# EAGLE board L1_2025_v1.4 (EAGLE 9.6.2), part 1 of 2
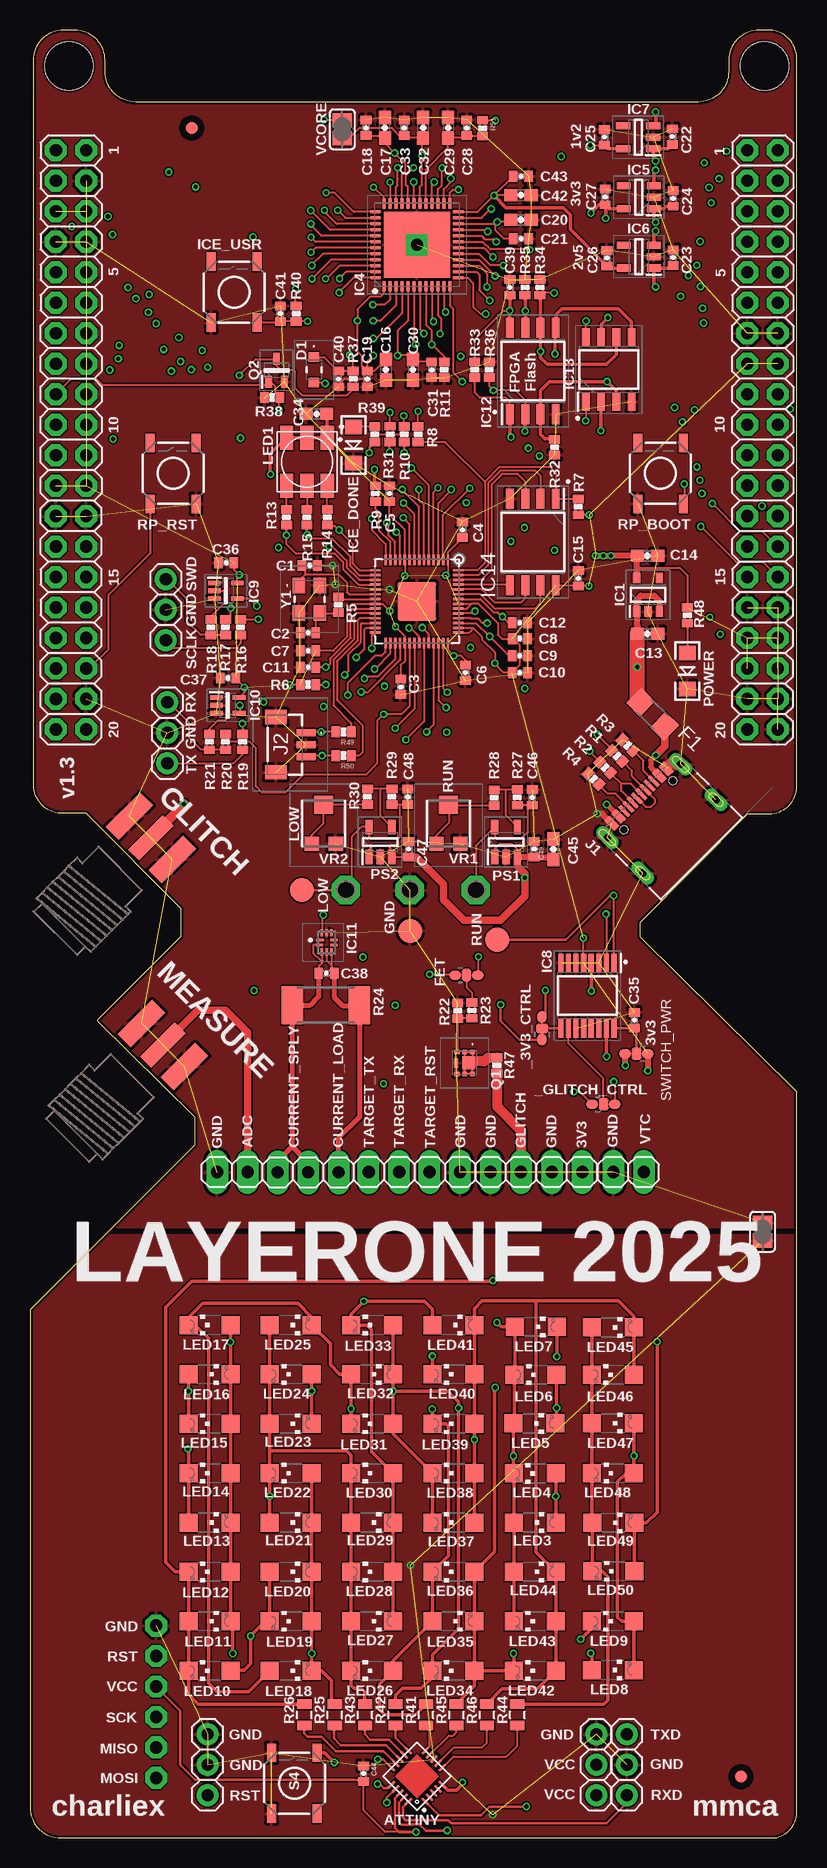
[diagram p6: board, top side]
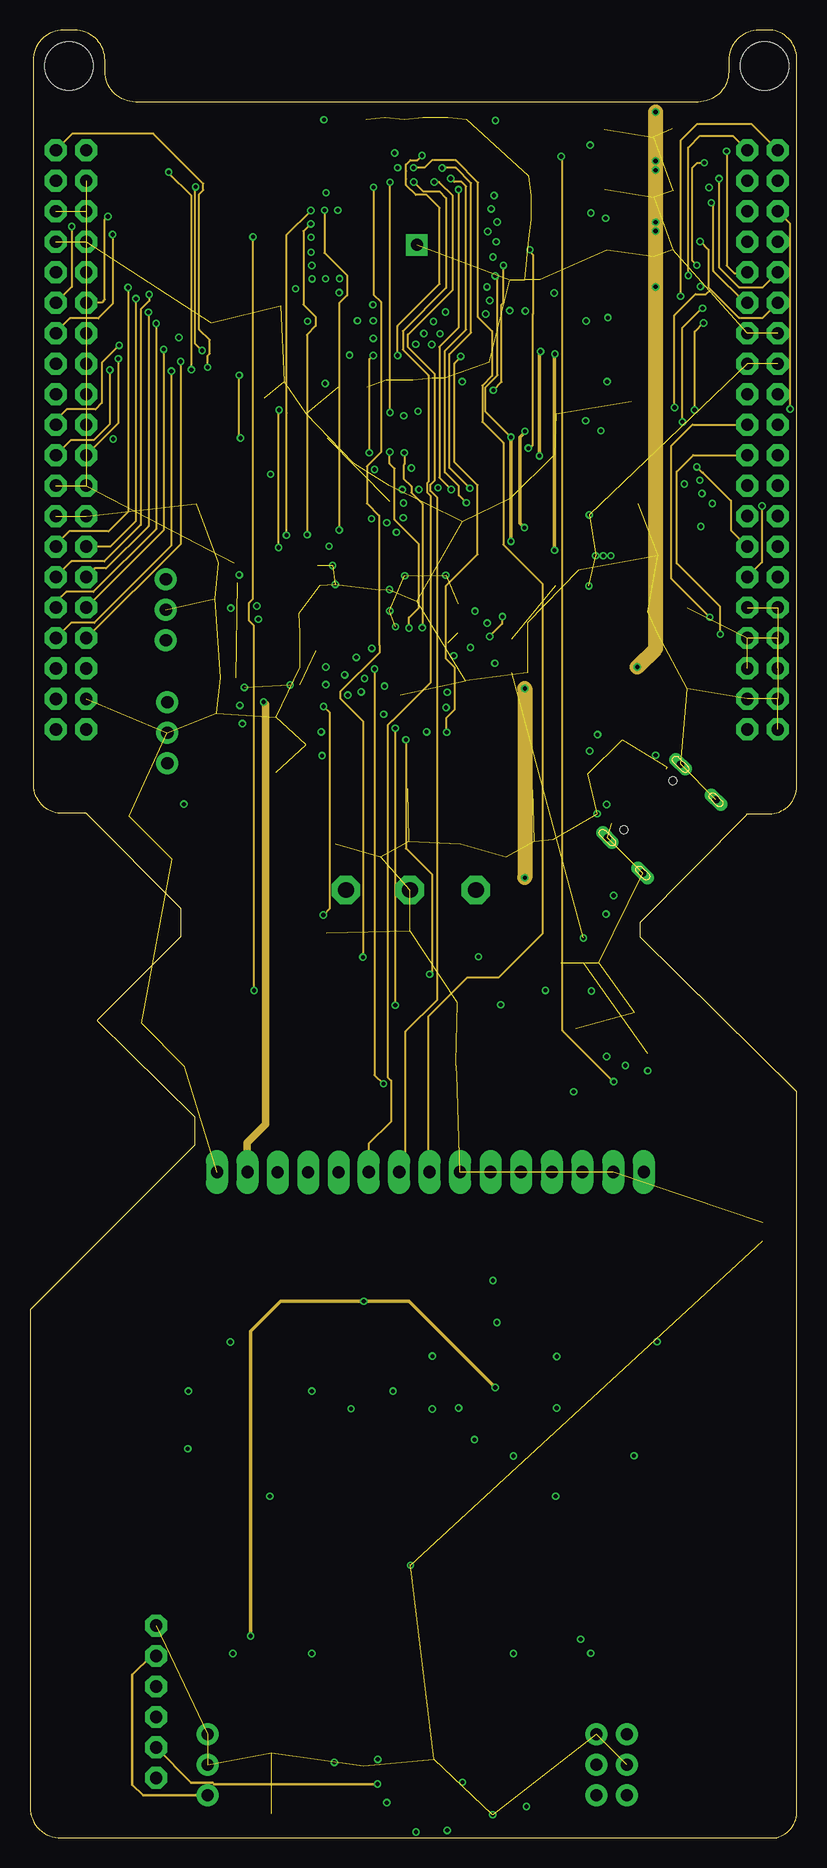
[diagram p7: board, inner layer Route2]
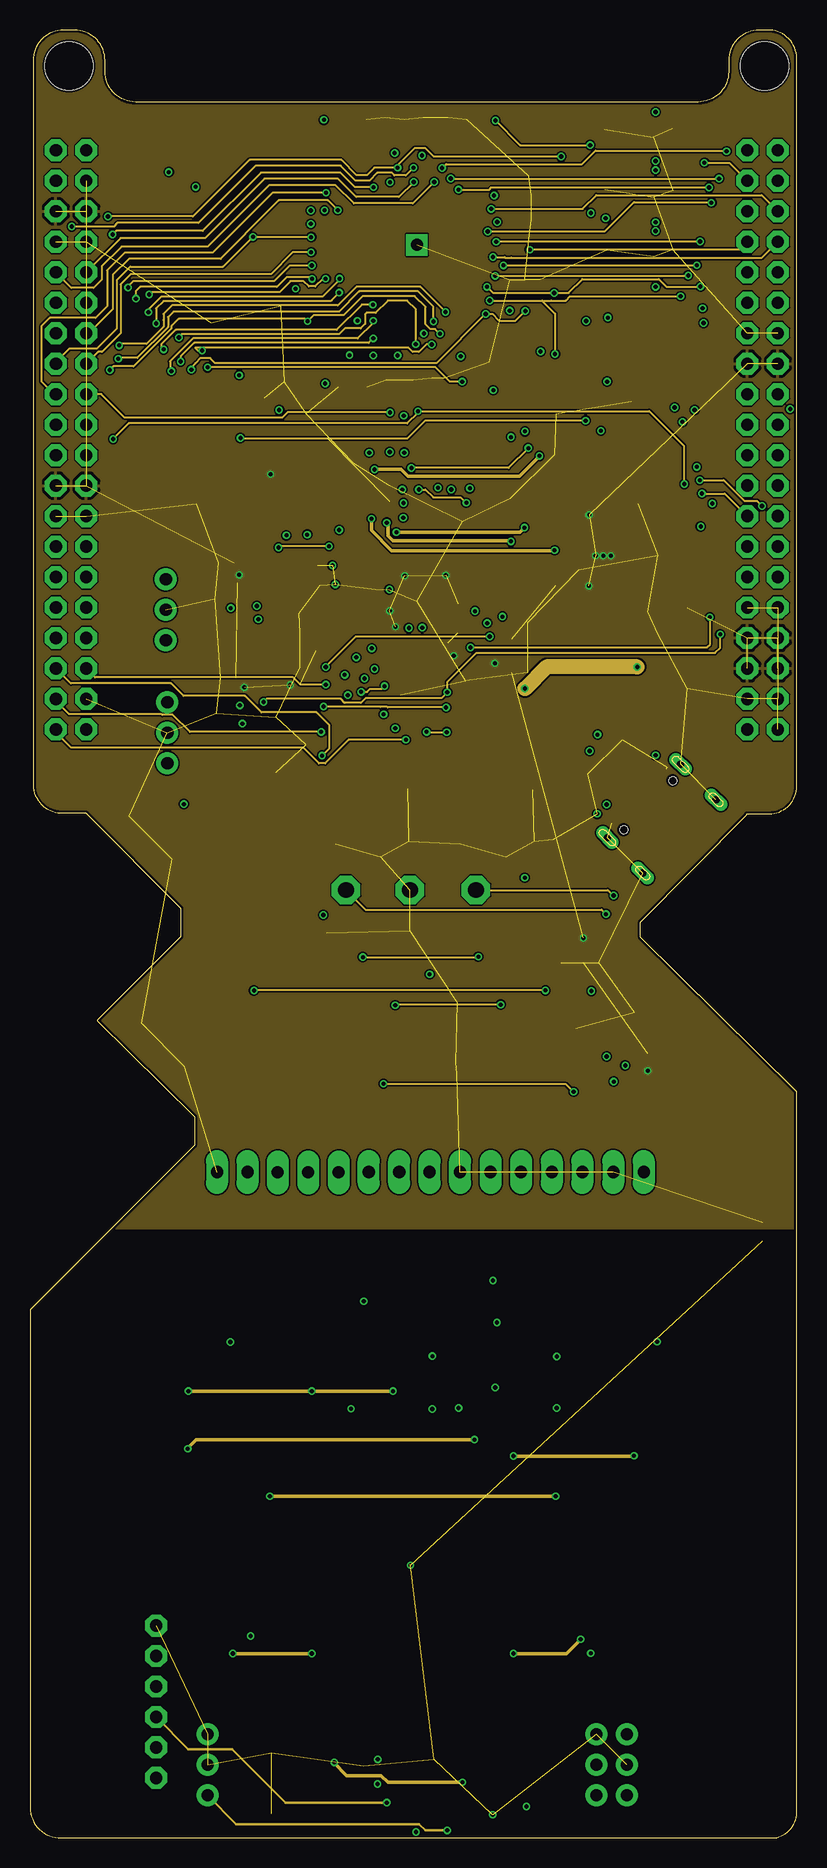
[diagram p8: board, inner layer Route15]
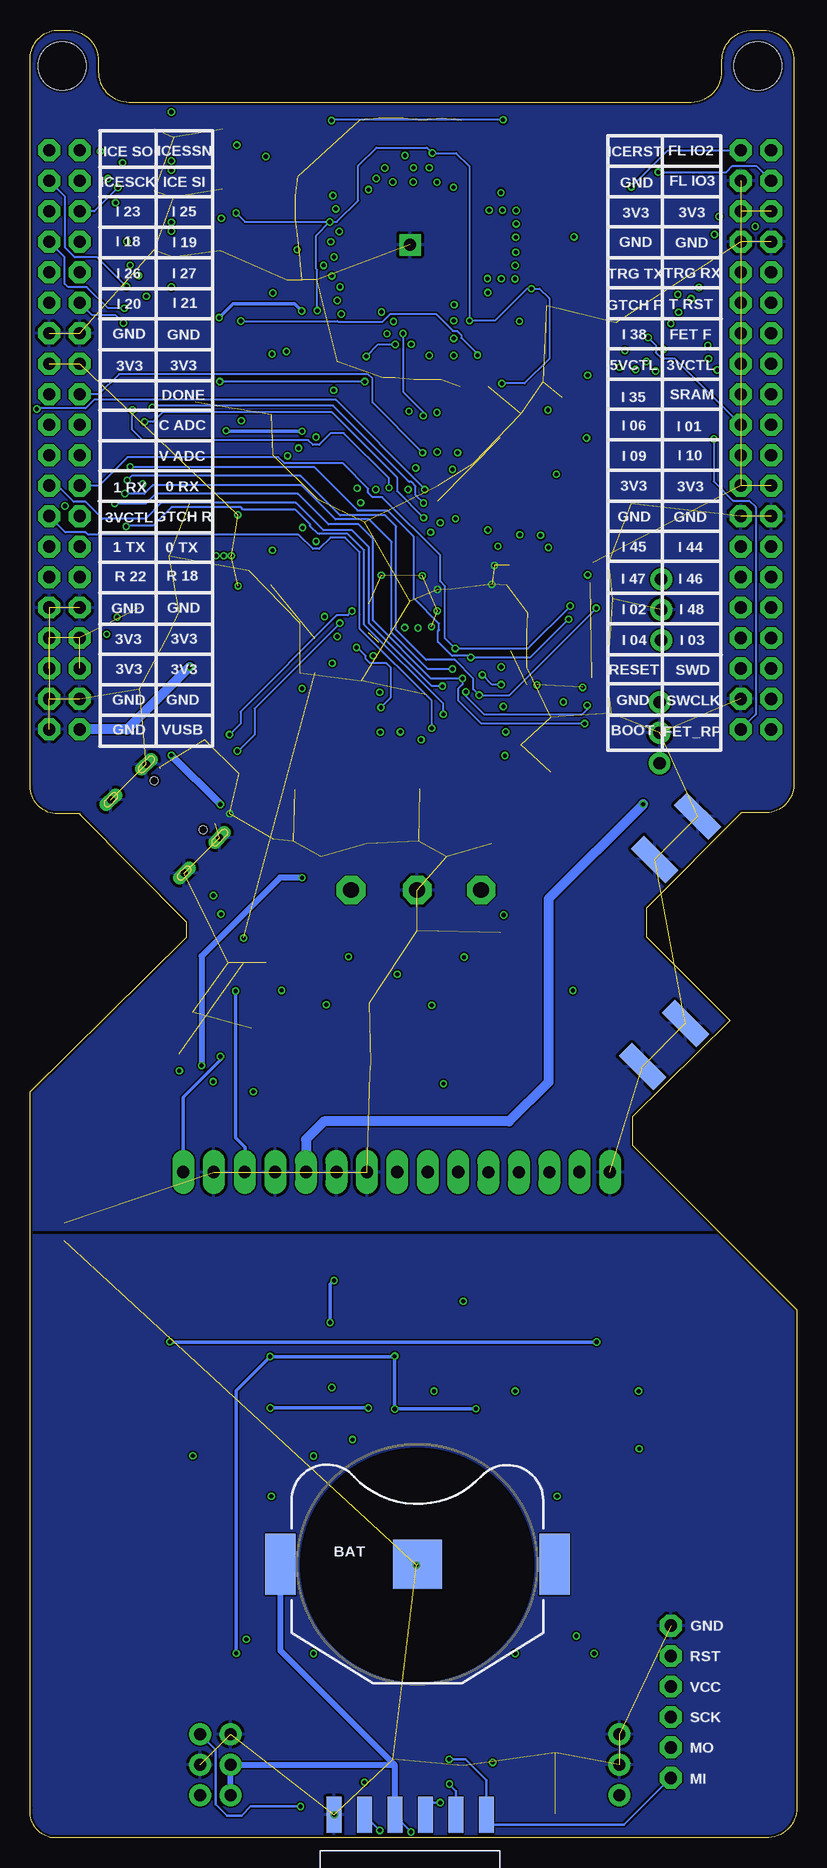
[diagram p9: board, bottom side, seen from below]

Size 63.96 x 150.67 mm. Coordinates in mm from the lower left corner, seen from the top.
Outline: 63.93,2.52 63.96,56.06 63.96,62.18 50.9,75.06 50.9,76.33 59.77,85.27 59.77,85.34 61.65,85.34 arc90 63.93,87.63 63.93,148.1 63.93,148.1 arc90 61.72,150.67 60.8,150.67 arc90 58.26,148.13 58.26,147.21 arc-90 55.72,144.67 8.8,144.67 arc-90 6.26,147.21 6.26,148.13 arc90 3.72,150.67 2.8,150.67 arc90 0.26,148.13 0.26,87.96 arc90 2.54,85.42 4.65,85.42 12.57,77.5 12.57,75.11 5.61,68.15 5.61,68.12 13.72,60.1 13.72,57.73 0,44.02 0,2.54 arc90 2.61,0 62.05,0 arc90 63.93,2.52
Copper layers (1+2*15+16): Top 0.035mm / dielectric 0.2mm / Route2 0.0175mm / dielectric 1.065mm / Route15 0.0175mm / dielectric 0.2mm / Bottom 0.035mm
Design rules "jlcpcb-4layers": minimum track width 3.5mil, minimum drill 0.2mm, track to track 5mil, track to pad 0.2mm, pad to pad 5mil, via to via 0.5mm, smd to smd 5mil, copper to edge 0.2mm, drill to drill 6mil, minimum pad ring 10mil, minimum via ring 0.13mm, stop-mask expansion 0.05mm, vias tented up to drill 16mil, thermal gap 10mil
Net classes: 1 LED: width 0.203 mm
Holes 4 mm at 61.26,147.67 3.26,147.67
bRestrict: area 25.8,16.9 to 37.5,28.6

## Footprints (pad centres in the part's own frame; a part is rotated, then mirrored left to right if it is on the bottom)
C0R-JMP = smd 0.8 x 1: 1 0,0.938; 3 0,-0.938 | smd 1 x 0.8: 2 0,0
1X03:1 = drill 1.016 long: 1 -2.54,0; 2 0,0; 3 2.54,0
FIDUCIAL_1MM = smd 1 x 1: 1 0,0
MLF20 = smd 0.8 x 0.23: P$1 -2,1; P$2 -2,0.5; P$3 -2,0; P$4 -2,-0.5; P$5 -2,-1; P$11 2,-1; P$12 2,-0.5; P$13 2,0; P$14 2,0.5; P$15 2,1 | smd 0.23 x 0.8: P$6 -1,-2; P$7 -0.5,-2; P$8 0,-2; P$9 0.5,-2; P$10 1,-2; P$16 1,2; P$17 0.5,2; P$18 0,2; P$19 -0.5,2; P$20 -1,2
SPARKFUN_BATTCOM_20MM_LINX = smd 2.54 x 5.08: 1 -11.43,0; 3 11.43,0 | smd 4.064 x 4.064: 2 0,0
0402-CAP = smd 0.7 x 0.9: 1 -0.65,0; 2 0.65,0
0603-CAP = smd 1.1 x 1: 1 -0.85,0; 2 0.85,0
RB500VM40TE17 = smd 0.9 x 0.8: 1 0,1.05; 2 0,-1.05
R1206 = smd 1.6 x 1.803: 1 -1.422,0; 2 1.422,0
SMA_EDGELAUNCH = smd 4.064 x 1.524: GND@1 2.032,-2.54; GND@2 2.032,2.54 | smd 4.064 x 1.524 bottom: GND@3 2.032,2.54; GND@4 2.032,-2.54 | smd 4.064 x 1.27: P 2.032,0
P1-13 = drill 1.321 pad 2.159 octagon: TP 0,0
SOT95P280X130-5N = smd 0.9 x 0.6: 1 -1.4,0.95; 2 -1.4,0; 3 -1.4,-0.95; 4 1.4,-0.95; 5 1.4,0.95
ADAFRUIT_MICRO_QFN56_7MM_REDUCEDEPAD = smd 0.875 x 0.2: 1 -3.45,2.6; 2 -3.45,2.2; 3 -3.45,1.8; 4 -3.45,1.4; 5 -3.45,1; 6 -3.45,0.6; 7 -3.45,0.2; 8 -3.45,-0.2; 9 -3.45,-0.6; 10 -3.45,-1; 11 -3.45,-1.4; 12 -3.45,-1.8; 13 -3.45,-2.2; 14 -3.45,-2.6; 29 3.45,-2.6; 30 3.45,-2.2; 31 3.45,-1.8; 32 3.45,-1.4; 33 3.45,-1; 34 3.45,-0.6; 35 3.45,-0.2; 36 3.45,0.2; 37 3.45,0.6; 38 3.45,1; 39 3.45,1.4; 40 3.45,1.8; 41 3.45,2.2; 42 3.45,2.6 | smd 0.2 x 0.875: 15 -2.6,-3.45; 16 -2.2,-3.45; 17 -1.8,-3.45; 18 -1.4,-3.45; 19 -1,-3.45; 20 -0.6,-3.45; 21 -0.2,-3.45; 22 0.2,-3.45; 23 0.6,-3.45; 24 1,-3.45; 25 1.4,-3.45; 26 1.8,-3.45; 27 2.2,-3.45; 28 2.6,-3.45; 43 2.6,3.45; 44 2.2,3.45; 45 1.8,3.45; 46 1.4,3.45; 47 1,3.45; 48 0.6,3.45; 49 0.2,3.45; 50 -0.2,3.45; 51 -0.6,3.45; 52 -1,3.45; 53 -1.4,3.45; 54 -1.8,3.45; 55 -2.2,3.45; 56 -2.6,3.45 | smd 3.2 x 3.2: P$1 0,0
QFN50P700X700X100-49N = smd 0.85 x 0.25: 1 -3.45,2.75; 2 -3.45,2.25; 3 -3.45,1.75; 4 -3.45,1.25; 5 -3.45,0.75; 6 -3.45,0.25; 7 -3.45,-0.25; 8 -3.45,-0.75; 9 -3.45,-1.25; 10 -3.45,-1.75; 11 -3.45,-2.25; 12 -3.45,-2.75; 25 3.45,-2.75; 26 3.45,-2.25; 27 3.45,-1.75; 28 3.45,-1.25; 29 3.45,-0.75; 30 3.45,-0.25; 31 3.45,0.25; 32 3.45,0.75; 33 3.45,1.25; 34 3.45,1.75; 35 3.45,2.25; 36 3.45,2.75 | smd 0.25 x 0.85: 13 -2.75,-3.45; 14 -2.25,-3.45; 15 -1.75,-3.45; 16 -1.25,-3.45; 17 -0.75,-3.45; 18 -0.25,-3.45; 19 0.25,-3.45; 20 0.75,-3.45; 21 1.25,-3.45; 22 1.75,-3.45; 23 2.25,-3.45; 24 2.75,-3.45; 37 2.75,3.45; 38 2.25,3.45; 39 1.75,3.45; 40 1.25,3.45; 41 0.75,3.45; 42 0.25,3.45; 43 -0.25,3.45; 44 -0.75,3.45; 45 -1.25,3.45; 46 -1.75,3.45; 47 -2.25,3.45; 48 -2.75,3.45 | smd 5.5 x 5.5: 49 0,0 | drill 1 square: P$1 0,0
SOT95P280X145-5N = smd 1.2 x 0.6: 1 -1.25,0.95; 2 -1.25,0; 3 -1.25,-0.95; 4 1.25,-0.95; 5 1.25,0.95
SOP64P602X175-16N = smd 1.55 x 0.435: 1 -2.725,2.222; 2 -2.725,1.588; 3 -2.725,0.952; 4 -2.725,0.318; 5 -2.725,-0.318; 6 -2.725,-0.952; 7 -2.725,-1.588; 8 -2.725,-2.222; 9 2.725,-2.222; 10 2.725,-1.588; 11 2.725,-0.952; 12 2.725,-0.318; 13 2.725,0.318; 14 2.725,0.952; 15 2.725,1.588; 16 2.725,2.222
SOT65P212X110-5N = smd 1.05 x 0.4: 1 -0.95,0.65; 2 -0.95,0; 3 -0.95,-0.65; 4 0.95,-0.65; 5 0.95,0.65
INA216A2RSWR = smd 0.7 x 0.2: 1 -0.55,0.2 | smd 0.6 x 0.2: 2 -0.6,-0.2; 6 0.6,-0.2; 7 0.6,0.2 | smd 0.2 x 0.6: 3 -0.4,-0.8; 4 0,-0.8; 5 0.4,-0.8; 8 0.4,0.8; 9 0,0.8; 10 -0.4,0.8
SOIC127P790X216-8N = smd 1.65 x 0.65: 1 -3.6,1.905; 2 -3.6,0.635; 3 -3.6,-0.635; 4 -3.6,-1.905; 5 3.6,-1.905; 6 3.6,-0.635; 7 3.6,0.635; 8 3.6,1.905
SOIC127P600X175-8N = smd 1.5 x 0.65: 1 -2.7,1.905; 2 -2.7,0.635; 3 -2.7,-0.635; 4 -2.7,-1.905; 5 2.7,-1.905; 6 2.7,-0.635; 7 2.7,0.635; 8 2.7,1.905
LED-1206 = smd 1.2 x 1.4: A -1.5,0; C 1.5,0
TACTILE_SWITCH_SMD = smd 1.524 x 0.762: 1 -2.54,1.905; 2 2.54,1.905; 3 -2.54,-1.905; 4 2.54,-1.905
GCT_USB4105-GF-A = smd 0.6 x 1.15: A1_B12 -3.2,4.755; A4_B9 -2.4,4.755; B1_A12 3.2,4.755; B4_A9 2.4,4.755 | smd 0.3 x 1.15: A5 -1.25,4.755; A6 -0.25,4.755; A7 0.25,4.755; A8 1.25,4.755; B5 1.75,4.755; B6 0.75,4.755; B7 -0.75,4.755; B8 -1.75,4.755 | drill 0.6 pad 1.05 long: S1 -4.32,4.18; S4 4.32,4.18 | drill 0.6 pad 1 long: S2 -4.32,0; S3 4.32,0 | hole 0.65: 2.89,3.68; -2.89,3.68
BM03BSRSSTBLFSN = smd 0.6 x 1.55: 1 -1,1.612; 2 0,1.612; 3 1,1.612 | smd 1.2 x 1.8: 4 -2.3,-0.912; 5 2.3,-0.912
1X02 = drill 1.016 long: 1 -1.27,0; 2 1.27,0
SPARKFUN-CONNECTORS_1X06-SMD-FEMALE-V2 = smd 1.25 x 3: 1 6.35,3.425; 2 3.81,3.425; 3 1.27,3.425; 4 -1.27,3.425; 5 -3.81,3.425; 6 -6.35,3.425
1X04 = drill 1.016 long: 1 -3.81,0; 2 -1.27,0; 3 1.27,0; 4 3.81,0
2X20-BIG = drill 1.016 pad 1.778 octagon: 1 -24.13,-1.27; 2 -24.13,1.27; 3 -21.59,-1.27; 4 -21.59,1.27; 5 -19.05,-1.27; 6 -19.05,1.27; 7 -16.51,-1.27; 8 -16.51,1.27; 9 -13.97,-1.27; 10 -13.97,1.27; 11 -11.43,-1.27; 12 -11.43,1.27; 13 -8.89,-1.27; 14 -8.89,1.27; 15 -6.35,-1.27; 16 -6.35,1.27; 17 -3.81,-1.27; 18 -3.81,1.27; 19 -1.27,-1.27; 20 -1.27,1.27; 21 1.27,-1.27; 22 1.27,1.27; 23 3.81,-1.27; 24 3.81,1.27; 25 6.35,-1.27; 26 6.35,1.27; 27 8.89,-1.27; 28 8.89,1.27; 29 11.43,-1.27; 30 11.43,1.27; 31 13.97,-1.27; 32 13.97,1.27; 33 16.51,-1.27; 34 16.51,1.27; 35 19.05,-1.27; 36 19.05,1.27; 37 21.59,-1.27; 38 21.59,1.27; 39 24.13,-1.27; 40 24.13,1.27
ADAFRUIT_1X06-CLEAN = drill 1.016 octagon: 1 -6.35,0; 2 -3.81,0; 3 -1.27,0; 4 1.27,0; 5 3.81,0; 6 6.35,0
RGBLED5050 = smd 2 x 1.1: 1 -2,1.7; 2 -2,0; 3 -2,-1.7; 4 2,-1.7; 5 2,0; 6 2,1.7
CHIPLED_1206 = smd 1.5 x 1.5: A 0,-1.75; C 0,1.75
1X03 = drill 1.016: 1 -2.54,0; 2 0,0; 3 2.54,0
RF4E070GNTR = smd 0.4 x 0.375: 1 -0.65,-0.912; 2 0,-0.912; 3 0.65,-0.912; 4 0.65,0.912; 5 0,0.912; 6 -0.65,0.912 | smd 1 x 1.1: 7 -0.325,0 | smd 0.3 x 0.8: 8 0.725,0
SOT65P210X110-3N = smd 1 x 0.55: 1 -0.95,0.65; 2 -0.95,-0.65; 3 0.95,0
0402-RES:1 = smd 0.7 x 0.9: 1 -0.65,0; 2 0.65,0
R2512 = smd 1.8 x 3.2: 1 -2.8,0; 2 2.8,0
0805 = smd 0.8 x 1.2: 1 -0.9,0; 2 0.9,0
TACTILE_SWITCH_SMD:1 = smd 1.524 x 0.762: 1 -2.54,1.905; 2 2.54,1.905; 3 -2.54,-1.905; 4 2.54,-1.905
SJ = smd 1.168 x 1.6: 1 -0.762,0; 2 0.762,0
TESTPAD_TP20R:1 = smd 2 x 2: TP 0,0
TC33X2503E = smd 1.2 x 1.2: 1 -1,-1.7; 3 1,-1.7 | smd 1.6 x 1.5: 2 0,1.55
ABM8-272-T3_ABM8272T3 = smd 1.3 x 1.05: 1 -1.15,-0.875; 2 1.15,-0.875; 3 1.15,0.875; 4 -1.15,0.875

## Placement (x,y rotation side)
_3V3_CTRL  0R-JUMPC  [C0R-JMP]  42.7,67.46 180 top
_GLITCH_CTRL  0R-JUMPC  [C0R-JMP]  47.83,61.14 90 top
ADC  [1X03:1]  23.19,55.47 180 top
AFID1  FIDUCIAL  [FIDUCIAL_1MM]  13.49,142.49 270 top
AFID2  FIDUCIAL  [FIDUCIAL_1MM]  59.28,5.1 270 top
ATTINY  tiny2313  [MLF20]  32.26,5.16 135 top
BAT  [SPARKFUN_BATTCOM_20MM_LINX]  31.65,22.81 0 bottom
C1  6pF  [0402-CAP]  23.32,106.05 180 top
C2  14pF  [0402-CAP]  23.19,100.43 0 top
C3  0.1uF  [0402-CAP]  30.91,95.94 90 top
C4  0.1uF  [0402-CAP]  36.07,109.02 270 top
C5  0.1uF  [0402-CAP]  29.97,112.04 270 top
C6  0.1uF  [0402-CAP]  36.32,97.1 90 top
C7  0.1uF  [0402-CAP]  23.19,98.93 0 top
C8  0.1uF  [0402-CAP]  40.84,99.95 180 top
C9  1uF  [0402-CAP]  40.84,98.53 180 top
C10  1uF  [0402-CAP]  40.84,97.1 180 top
C11  0.1uF  [0402-CAP]  23.19,97.56 0 top
C12  0.1uF  [0402-CAP]  40.84,101.27 180 top
C13  10uF  [0603-CAP]  51.49,100.36 0 top
C14  10uF  [0603-CAP]  51.49,106.86 0 top
C15  0.1uF  [0402-CAP]  45.72,104.98 270 top
C16  4.7uF  [0603-CAP]  29.67,122.35 270 top
C17  4.7uF  [0603-CAP]  29.59,142.52 90 top
C18  0.1uF  [0402-CAP]  28.02,142.52 270 top
C19  0.1uF  [0402-CAP]  28.12,121.59 270 top
C20  4.7uF  [0603-CAP]  40.94,134.85 0 top
C21  0.1uF  [0402-CAP]  40.94,133.27 180 top
C22  1uF  [0402-CAP]  53.57,141.78 270 top
C23  1uF  [0402-CAP]  53.62,131.7 270 top
C24  1uF  [0402-CAP]  53.62,136.63 270 top
C25  1uF  [0402-CAP]  47.9,141.73 270 top
C26  1uF  [0402-CAP]  48.11,131.65 270 top
C27  1uF  [0402-CAP]  47.96,136.75 270 top
C28  0.1uF  [0402-CAP]  36.42,142.52 270 top
C29  4.7uF  [0603-CAP]  34.87,142.52 270 top
C30  4.7uF  [0603-CAP]  31.93,122.35 270 top
C31  0.1uF  [0402-CAP]  33.5,122.35 270 top
C32  4.7uF  [0603-CAP]  32.79,142.52 90 top
C33  0.1uF  [0402-CAP]  31.22,142.52 270 top
C34  4.7uF  [0603-CAP]  23.88,118.67 0 top
C35  0.1uF  [0402-CAP]  50.39,68.15 90 top
C36  0.1uF  [0402-CAP]  16.36,106.27 180 top
C37  0.1uF  [0402-CAP]  16.51,96.67 180 top
C38  0.1uF C0G  [0402-CAP]  24.71,72.06 180 top
C39  0.1uF  [0402-CAP]  40.03,129.21 270 top
C40  0.1uF  [0402-CAP]  25.73,121.59 90 top
C41  0.1uF  [0402-CAP]  20.88,127.03 270 top
C42  4.7uF  [0603-CAP]  40.94,136.91 0 top
C43  0.1uF  [0402-CAP]  40.94,138.48 180 top
C44  0.1uF  [0402-CAP]  27.81,5.36 270 top
C45  1uF  [0402-CAP]  42.04,82.4 270 top
C46  1uF  [0402-CAP]  41.88,86.72 270 top
C47  1uF  [0402-CAP]  31.57,82.4 270 top
C48  1uF  [0402-CAP]  31.5,86.77 270 top
C49  10uF  [0603-CAP]  43.64,82.4 90 top
D1  RB500VM-40TE-17  [RB500VM40TE17]  23.67,122.35 0 top
F1  750mA  [R1206]  51.92,93.65 135 top
FET  0R-JUMPC  [C0R-JMP]  36.4,71.91 90 top
GLITCH  Test  [SMA_EDGELAUNCH]  8.64,81.91 45 top
GND  PTR1PAD1-13  [P1-13]  31.67,78.99 270 top
IC1  XC6210B332MR-G  [SOT95P280X130-5N]  51.54,103.61 90 top
IC2  ADAFRUIT_MICRO_RP2040_QFN56  [ADAFRUIT_MICRO_QFN56_7MM_REDUCEDEPAD]  32.26,103.05 270 top
IC4  ICE40UP5K-SG48ITR  [QFN50P700X700X100-49N]  32.26,132.77 90 top
IC5  TLV77333PDBVR  [SOT95P280X145-5N]  50.77,136.73 180 top
IC6  TLV77325PDBVR  [SOT95P280X145-5N]  50.77,131.78 180 top
IC7  TLV77312PDBVR  [SOT95P280X145-5N]  50.72,141.73 180 top
IC8  MAX4583EEE+  [SOP64P602X175-16N]  46.48,70.21 270 top
IC9  74AUP1T17GWH  [SOT65P212X110-5N]  16.33,103.94 0 top
IC10  74AUP1T17GWH  [SOT65P212X110-5N]  16.48,94.39 0 top
IC11  INA216A2RSWR  [INA216A2RSWR]  24.74,74.63 0 top
IC12  W25Q32JVSSIQ_TR  [SOIC127P790X216-8N]  41.94,122.25 90 top
IC13  APS6404L-3SQN-SN  [SOIC127P600X175-8N]  48.26,122.38 90 top
IC14  W25Q32JVSSIQ_TR  [SOIC127P790X216-8N]  41.94,108 270 top
ICE_DONE  BLUE  [LED-1206]  26.97,116.08 270 top
ICE_USR  SWITCH-MOMENTARY-2SMD  [TACTILE_SWITCH_SMD]  17.02,128.83 90 top
J1  USB4105-GF-A  [GCT_USB4105-GF-A]  54.15,83.46 45 top
J2  BM03B-SRSS-TB_LF__SN_  [BM03BSRSSTBLFSN]  21.41,91.11 270 top
JP1  [1X02]  49.91,55.5 180 top
JP2  [SPARKFUN-CONNECTORS_1X06-SMD-FEMALE-V2]  32.26,-1.5 0 bottom
JP3  [1X02]  44.78,55.5 180 top
JP4  [1X02]  39.67,55.5 180 top
JP5  [1X02]  16.87,55.5 180 top
JP6  [1X04]  32.05,55.5 0 top
JP7  [2X20-BIG]  3.43,116.51 270 top
JP8  [2X20-BIG]  61.09,116.51 270 top
JP9  [ADAFRUIT_1X06-CLEAN]  10.52,11.35 90 top
LED1  RGBLED5050  [RGBLED5050]  23.09,114.68 270 top
LED3  RED  [CHIPLED_1206]  42.09,26.29 270 top
LED4  RED  [CHIPLED_1206]  42.09,30.38 90 top
LED5  RED  [CHIPLED_1206]  42.06,34.54 270 top
LED6  RED  [CHIPLED_1206]  42.16,38.61 90 top
LED7  RED  [CHIPLED_1206]  42.19,42.6 270 top
LED8  RED  [CHIPLED_1206]  48.59,14 270 top
LED9  RED  [CHIPLED_1206]  48.59,18.06 90 top
LED10  RED  [CHIPLED_1206]  14.96,13.94 90 top
LED11  RED  [CHIPLED_1206]  14.96,18.06 270 top
LED12  [CHIPLED_1206]  14.96,22.17 90 top
LED13  RED  [CHIPLED_1206]  14.96,26.29 270 top
LED14  RED  [CHIPLED_1206]  14.96,30.4 90 top
LED15  RED  [CHIPLED_1206]  14.96,34.52 90 top
LED16  RED  [CHIPLED_1206]  14.96,38.63 270 top
LED17  RED  [CHIPLED_1206]  14.96,42.75 90 top
LED18  RED  [CHIPLED_1206]  21.74,13.94 270 top
LED19  RED  [CHIPLED_1206]  21.74,18.06 90 top
LED20  [CHIPLED_1206]  21.74,22.17 270 top
LED21  RED  [CHIPLED_1206]  21.74,26.29 270 top
LED22  RED  [CHIPLED_1206]  21.74,30.4 90 top
LED23  RED  [CHIPLED_1206]  21.74,34.52 270 top
LED24  RED  [CHIPLED_1206]  21.74,38.63 90 top
LED25  RED  [CHIPLED_1206]  21.74,42.75 270 top
LED26  RED  [CHIPLED_1206]  28.52,13.94 90 top
LED27  RED  [CHIPLED_1206]  28.52,18.06 270 top
LED28  RED  [CHIPLED_1206]  28.52,22.17 90 top
LED29  RED  [CHIPLED_1206]  28.52,26.29 270 top
LED30  RED  [CHIPLED_1206]  28.52,30.4 90 top
LED31  RED  [CHIPLED_1206]  28.52,34.52 90 top
LED32  RED  [CHIPLED_1206]  28.52,38.63 270 top
LED33  RED  [CHIPLED_1206]  28.52,42.75 90 top
LED34  RED  [CHIPLED_1206]  35.31,13.94 90 top
LED35  RED  [CHIPLED_1206]  35.31,18.06 270 top
LED36  RED  [CHIPLED_1206]  35.31,22.17 90 top
LED37  RED  [CHIPLED_1206]  35.31,26.29 90 top
LED38  [CHIPLED_1206]  35.31,30.4 90 top
LED39  RED  [CHIPLED_1206]  35.31,34.52 90 top
LED40  RED  [CHIPLED_1206]  35.31,38.63 90 top
LED41  RED  [CHIPLED_1206]  35.31,42.75 270 top
LED42  RED  [CHIPLED_1206]  42.09,13.94 90 top
LED43  RED  [CHIPLED_1206]  42.09,18.06 90 top
LED44  RED  [CHIPLED_1206]  42.09,22.17 270 top
LED45  RED  [CHIPLED_1206]  48.62,42.55 270 top
LED46  RED  [CHIPLED_1206]  48.59,38.61 90 top
LED47  RED  [CHIPLED_1206]  48.62,34.57 270 top
LED48  RED  [CHIPLED_1206]  48.62,30.4 90 top
LED49  RED  [CHIPLED_1206]  48.64,26.26 270 top
LED50  RED  [CHIPLED_1206]  48.67,22.22 90 top
LOW  PTR1PAD1-13  [P1-13]  26.34,78.99 270 top
MEASURE  [SMA_EDGELAUNCH]  9.65,64.64 45 top
POWER  GREEN  [LED-1206]  54.81,97.26 270 top
PS1  TLV75801PDBVR  [SOT95P280X145-5N]  39.7,83.01 90 top
PS2  TLV75801PDBVR  [SOT95P280X145-5N]  29.21,83.01 90 top
PWR  [1X03]  47.22,6.1 270 top
Q1  RF4E070GNTR  [RF4E070GNTR]  36.25,64.59 180 top
Q2  2N7002PW  [SOT65P210X110-3N]  20.55,122.3 90 top
R1  22R  [0402-RES:1]  48.95,90.17 315 top
R2  22R  [0402-RES:1]  47.96,89.2 315 top
R3  5.1K  [0402-RES:1]  49.83,91.06 315 top
R4  5.1K  [0402-RES:1]  46.99,88.24 315 top
R5  1K  [0402-RES:1]  25.7,102.77 270 top
R6  10K  [0402-RES:1]  23.19,96.11 0 top
R7  10K  [0402-RES:1]  45.72,110.92 90 top
R8  1K  [0402-RES:1]  32.36,116.97 90 top
R9  22R  [0402-RES:1]  28.8,112.04 90 top
R10  22R  [0402-RES:1]  31.22,116.97 270 top
R11  10K  [0402-RES:1]  34.54,122.35 270 top
R13  10K  [0402-RES:1]  21.39,110.06 90 top
R14  5.1K  [0402-RES:1]  24.79,110.06 90 top
R15  1K  [0402-RES:1]  23.09,110.06 90 top
R16  100R  [0402-RES:1]  17.55,100.89 270 top
R17  100R  [0402-RES:1]  16.31,100.89 270 top
R18  100R  [0402-RES:1]  15.09,100.89 270 top
R19  100R  [0402-RES:1]  17.73,91.34 270 top
R20  100R  [0402-RES:1]  16.31,91.34 270 top
R21  100R  [0402-RES:1]  14.96,91.34 270 top
R22  10K  [0402-RES:1]  35.66,68.94 270 top
R23  22R  [0402-RES:1]  36.86,68.96 90 top
R24  0.100R  [R2512]  24.66,69.39 180 top
R25  220  [0805]  25.4,10.26 90 top
R26  220  [0805]  22.86,10.26 90 top
R27  18K  [0402-RES:1]  40.64,86.72 270 top
R28  1.6K  [0402-RES:1]  38.71,86.69 90 top
R29  18K  [0402-RES:1]  30.18,86.77 270 top
R30  1.6K  [0402-RES:1]  28.14,86.77 90 top
R31  22R  [0402-RES:1]  30.02,116.99 270 top
R32  10K  [0402-RES:1]  43.74,115.9 270 top
R33  10K  [0402-RES:1]  37.08,122.35 270 top
R34  10K  [0402-RES:1]  42.52,129.21 90 top
R35  10K  [0402-RES:1]  41.28,129.21 90 top
R36  10K  [0402-RES:1]  38.3,122.35 90 top
R37  5.1K  [0402-RES:1]  26.95,121.59 270 top
R38  10K  [0402-RES:1]  20.19,120.04 180 top
R39  1K  [0402-RES:1]  28.75,116.97 270 top
R40  10K  [0402-RES:1]  22.2,127.03 270 top
R41  220  [0805]  33.02,10.26 90 top
R42  220  [0805]  30.48,10.26 90 top
R43  220  [0805]  27.94,10.26 90 top
R44  220  [0805]  40.64,10.26 90 top
R45  220  [0805]  35.56,10.26 90 top
R46  220  [0805]  38.1,10.26 90 top
R47  22R  [0402-RES:1]  38.94,64.39 90 top
R48  5.1K  [0402-RES:1]  54.81,101.88 90 top
R49  100R  [0402-RES:1]  26.14,92.18 180 top
R50  100R  [0402-RES:1]  26.14,90.2 180 top
R51  100R  [0402-RES:1]  37.74,142.49 270 top
RP_BOOT  SWITCH-MOMENTARY-2SMD  [TACTILE_SWITCH_SMD]  52.58,113.72 90 top
RP_RST  SWITCH-MOMENTARY-2SMD  [TACTILE_SWITCH_SMD]  11.94,113.72 90 top
RST  [1X03]  14.81,6.1 270 top
RUN  PTR1PAD1-13  [P1-13]  37.19,78.99 270 top
S4  [TACTILE_SWITCH_SMD:1]  22.05,4.57 90 top
SJ2  [SJ]  61.09,50.52 270 top
SWD  [1X03]  11.33,102.36 90 top
SWITCH_PWR  0R-JUMPC  [C0R-JMP]  50.57,65.35 270 top
TP1  TESTPAD_TPSTP20R  [TESTPAD_TP20R:1]  38.96,74.85 270 top
TP2  TESTPAD_TPSTP20R  [TESTPAD_TP20R:1]  22.68,78.99 270 top
TP3  TESTPAD_TPSTP20R  [TESTPAD_TP20R:1]  31.7,75.59 270 top
TX_RX  [1X03]  49.76,6.1 270 top
UART  [1X03]  11.46,92.1 90 top
VCORE  [SJ]  26.04,142.39 270 top
VR1  TC33X-2-104E  [TC33X2503E]  34.9,84.56 0 top
VR2  TC33X-2-104E  [TC33X2503E]  24.49,84.56 0 top
Y1  ABM8-272-T3_ABM8-272-T3  [ABM8-272-T3_ABM8272T3]  23.29,103.23 270 top